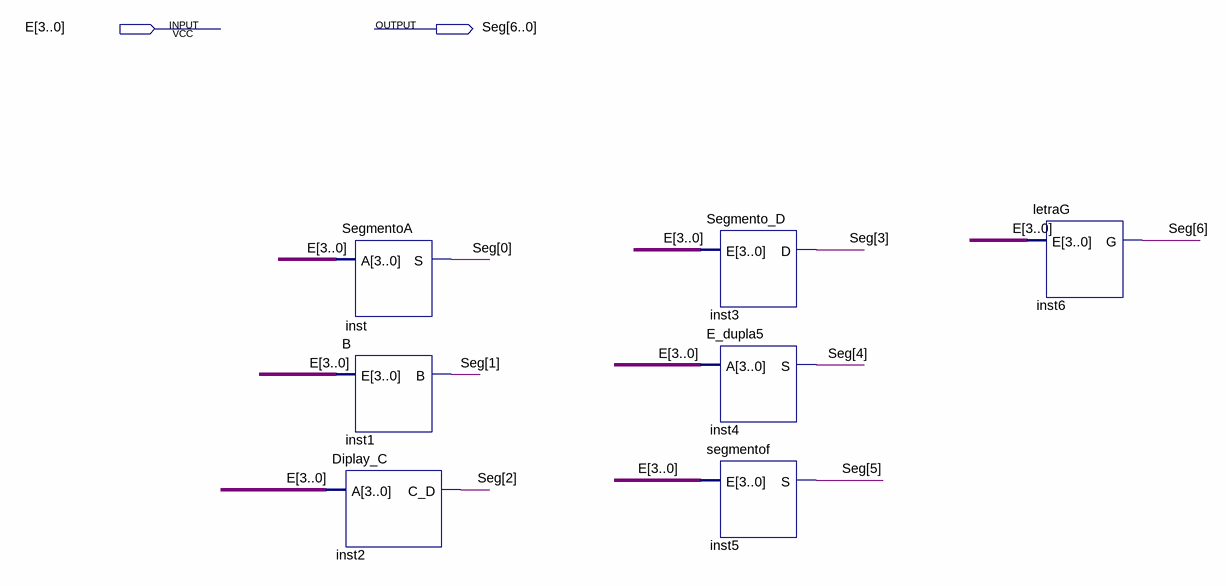
[diagram p0: schematic sheet]
// Quartus schematic hseg.bdf as structural Verilog: 7 symbols, 2 pins
module hseg (
  input  [3:0] E,
  output [6:0] Seg
);

  SegmentoA inst (.A(E), .S(Seg[0]));
  B inst1 (.E(E), .B(Seg[1]));
  Diplay_C inst2 (.A(E), .C_D(Seg[2]));
  Segmento_D inst3 (.E(E), .D(Seg[3]));
  E_dupla5 inst4 (.A(E), .S(Seg[4]));
  segmentof inst5 (.E(E), .S(Seg[5]));
  letraG inst6 (.E(E), .G(Seg[6]));
endmodule
